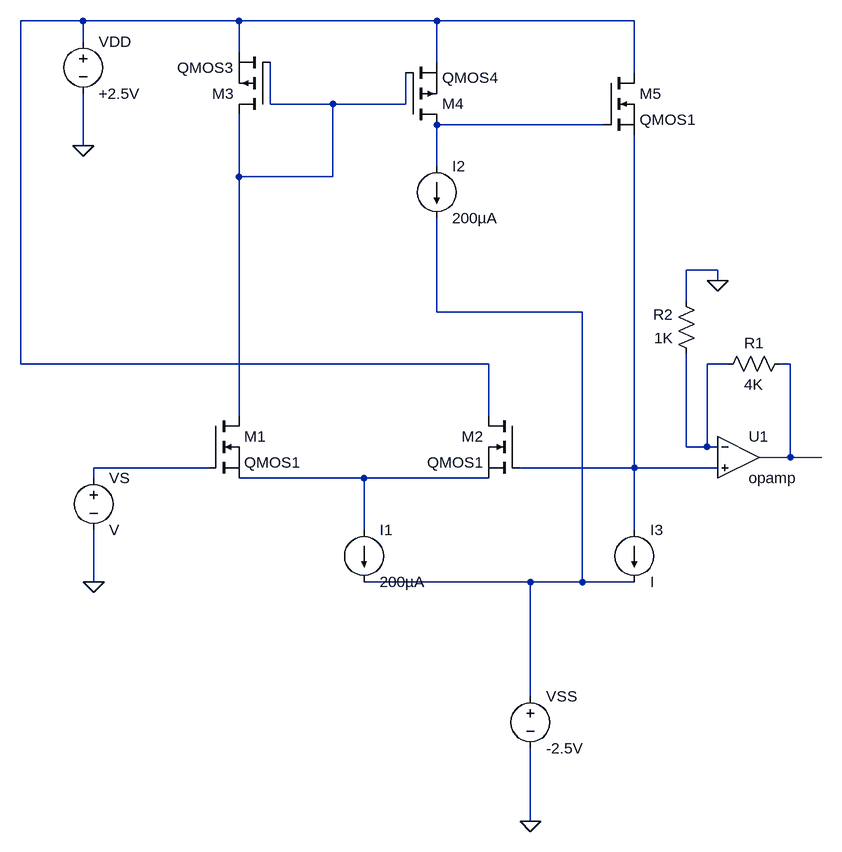
[diagram p0: schematic Assignment3_PartE.asc]
Assignment3_PartE.asc, the LTspice schematic file:
Version 4
SHEET 1 1060 708
WIRE -80 -544 -176 -544
WIRE 160 -544 -80 -544
WIRE 464 -544 160 -544
WIRE 768 -544 464 -544
WIRE -80 -512 -80 -544
WIRE 160 -496 160 -544
WIRE 464 -480 464 -544
WIRE 768 -464 768 -544
WIRE 208 -416 208 -480
WIRE 304 -416 208 -416
WIRE 416 -416 416 -464
WIRE 416 -416 304 -416
WIRE 720 -384 464 -384
WIRE -80 -352 -80 -432
WIRE 464 -320 464 -384
WIRE 160 -304 160 -400
WIRE 304 -304 304 -416
WIRE 304 -304 160 -304
WIRE 896 -160 848 -160
WIRE 896 -144 896 -160
WIRE 848 -112 848 -160
WIRE 464 -96 464 -240
WIRE 688 -96 464 -96
WIRE -176 -16 -176 -544
WIRE 544 -16 -176 -16
WIRE 912 -16 880 -16
WIRE 1008 -16 992 -16
WIRE 160 64 160 -304
WIRE 544 64 544 -16
WIRE 848 112 848 -32
WIRE 880 112 880 -16
WIRE 880 112 848 112
WIRE 896 112 880 112
WIRE 1008 128 1008 -16
WIRE 1008 128 960 128
WIRE 1056 128 1008 128
WIRE 112 144 -64 144
WIRE 768 144 768 -368
WIRE 768 144 592 144
WIRE 896 144 768 144
WIRE -64 160 -64 144
WIRE 352 160 160 160
WIRE 544 160 352 160
WIRE 352 240 352 160
WIRE 768 240 768 144
WIRE -64 320 -64 240
WIRE 608 320 352 320
WIRE 688 320 688 -96
WIRE 688 320 608 320
WIRE 768 320 688 320
WIRE 608 496 608 320
WIRE 608 688 608 576
FLAG -64 320 0
FLAG 608 688 0
FLAG -80 -352 0
FLAG 896 -144 0
SYMBOL nmos 112 64 R0
SYMATTR InstName M1
SYMATTR Value QMOS1
SYMBOL nmos 592 64 M0
SYMATTR InstName M2
SYMATTR Value QMOS1
SYMBOL nmos 720 -464 R0
SYMATTR InstName M5
SYMATTR Value QMOS1
SYMBOL current 352 240 R0
SYMATTR InstName I1
SYMATTR Value 200µA
SYMBOL current 768 240 R0
SYMATTR InstName I3
SYMBOL current 464 -320 R0
SYMATTR InstName I2
SYMATTR Value 200µA
SYMBOL pmos 416 -384 M180
SYMATTR InstName M4
SYMATTR Value QMOS4
SYMBOL pmos 208 -400 R180
SYMATTR InstName M3
SYMATTR Value QMOS3
SYMBOL voltage -64 144 R0
SYMATTR InstName VS
SYMBOL voltage 608 480 R0
SYMATTR InstName VSS
SYMATTR Value -2.5V
SYMBOL voltage -80 -528 R0
SYMATTR InstName VDD
SYMATTR Value +2.5V
SYMBOL Opamps\\opamp 928 64 R0
SYMATTR InstName U1
SYMBOL res 1008 -32 R90
WINDOW 0 0 56 VBottom 2
WINDOW 3 32 56 VTop 2
SYMATTR InstName R1
SYMATTR Value 4K
SYMBOL res 864 -16 R180
WINDOW 0 36 76 Left 2
WINDOW 3 36 40 Left 2
SYMATTR InstName R2
SYMATTR Value 1K

The netlist it stands for:
* Assignment3_PartE.asc
M1 N002 N007 N009 N009 QMOS1
M2 N001 N008 N009 N009 QMOS1
M5 N001 N003 N008 N008 QMOS1
I1 N009 N004 200µA
I3 N008 N004 I
I2 N003 N004 200µA
M4 N003 N002 N001 N001 QMOS4
M3 N002 N002 N001 N001 QMOS3
VS N007 0 V
VSS N004 0 -2.5V
VDD N001 0 +2.5V
XU1 N005 N008 N006 opamp Aol=100K GBW=10Meg  ; pins invin noninvin out
R1 N006 N005 4K
R2 N005 0 1K
.model NMOS NMOS
.model PMOS PMOS
.lib standard.mos
.backanno
.end